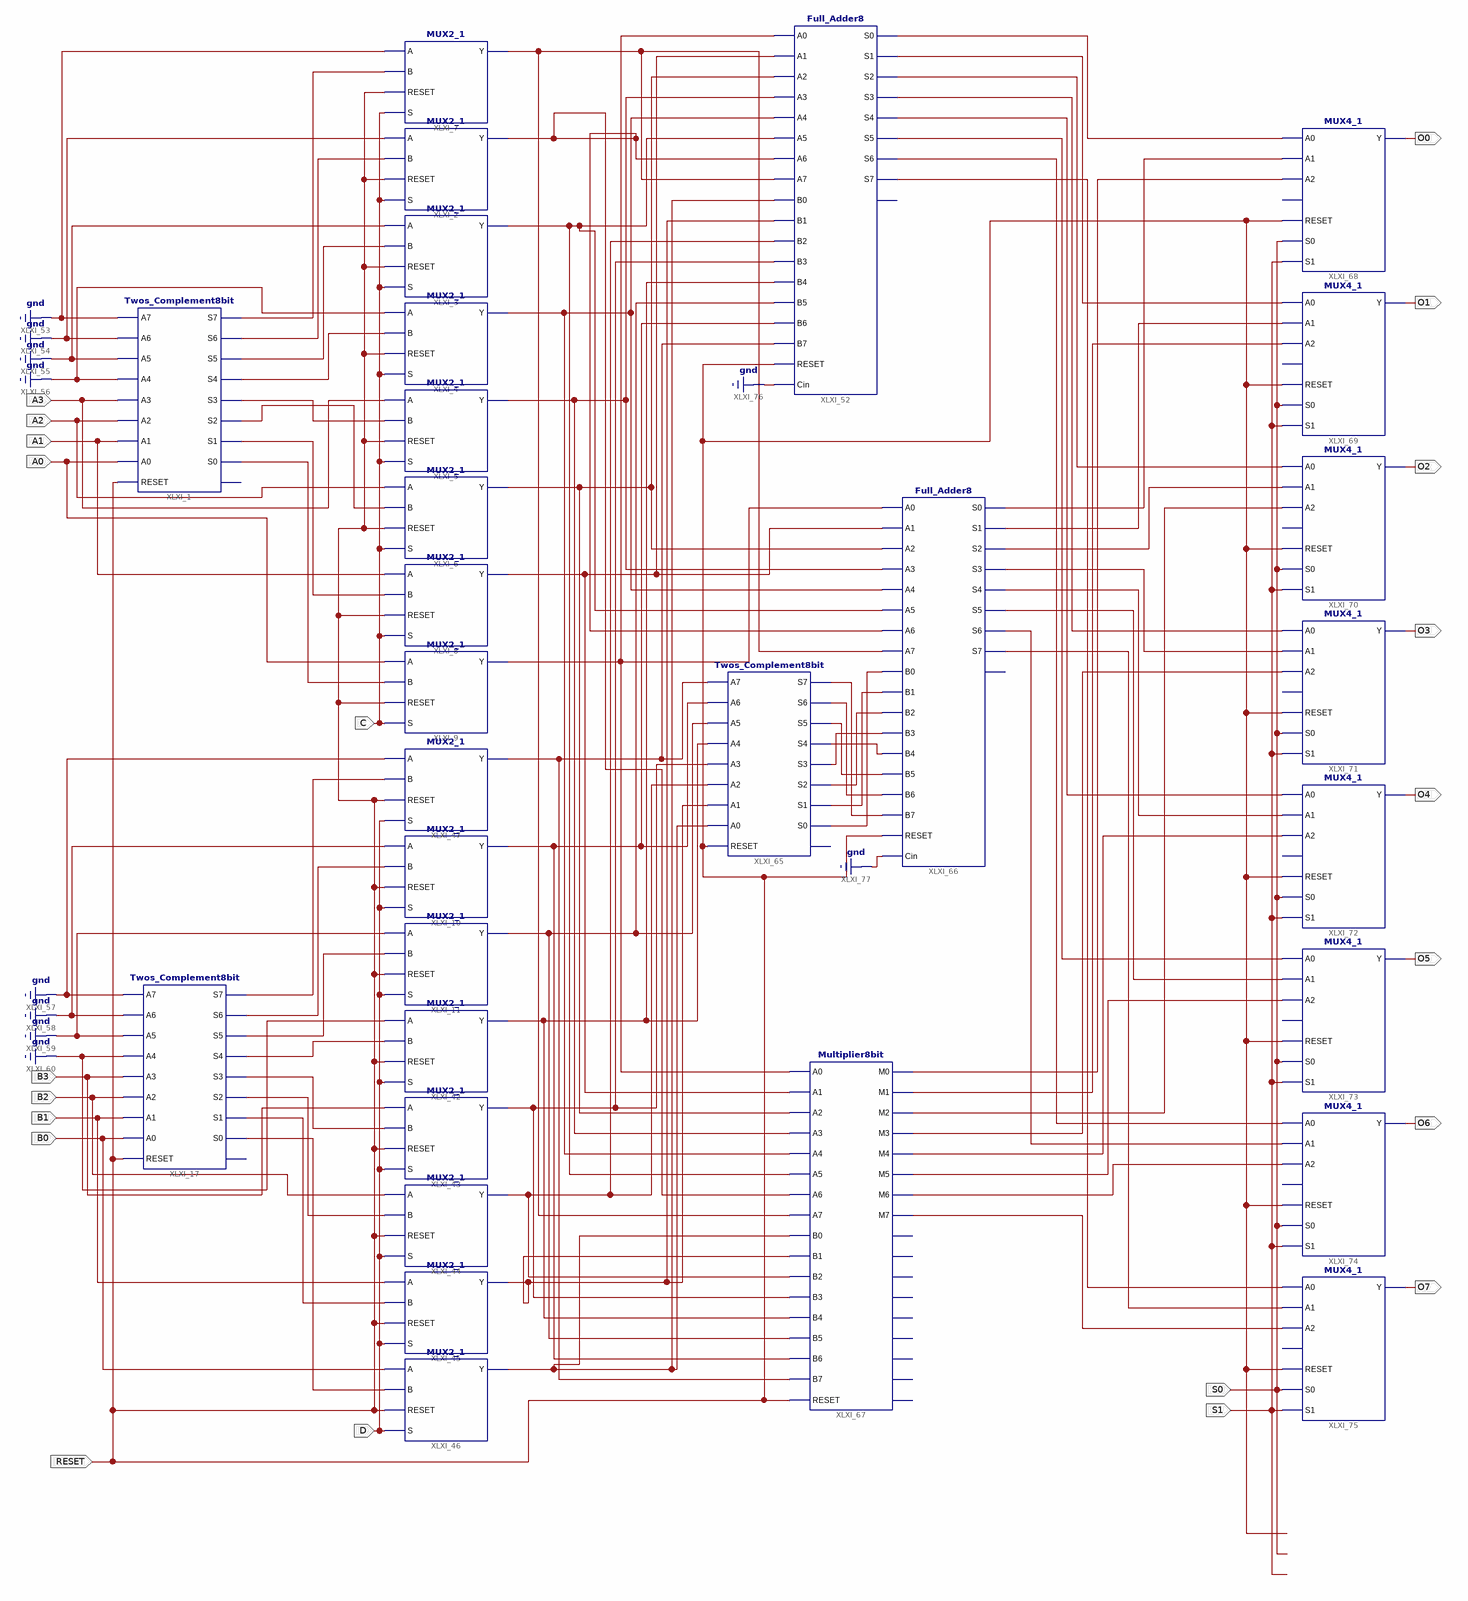
[diagram p0: schematic sheet 1]
// Xilinx ISE schematic Sign_Calculator_Led.sch (artix7) as structural Verilog: 30 symbols, 21 ports
module Sign_Calculator_Led (
  input  A3,
  input  A2,
  input  A0,
  input  B3,
  input  B2,
  input  B1,
  input  B0,
  input  C,
  input  D,
  input  S0,
  input  S1,
  input  RESET,
  input  A1,
  output O7,
  output O6,
  output O5,
  output O4,
  output O3,
  output O0,
  output O1,
  output O2
);

  wire XLXN_9, XLXN_12, XLXN_13, XLXN_14, XLXN_15, XLXN_16, XLXN_17, XLXN_18, XLXN_28, XLXN_29, XLXN_30,
       XLXN_31, XLXN_32, XLXN_33, XLXN_34, XLXN_40, XLXN_118, XLXN_125, XLXN_126, XLXN_130, XLXN_131,
       XLXN_132, XLXN_133, XLXN_134, XLXN_135, XLXN_136, XLXN_137, XLXN_139, XLXN_140, XLXN_141, XLXN_142,
       XLXN_144, XLXN_146, XLXN_147, XLXN_148, XLXN_150, XLXN_151, XLXN_152, XLXN_153, XLXN_154, XLXN_155,
       XLXN_157, XLXN_158, XLXN_159, XLXN_160, XLXN_161, XLXN_163, XLXN_165, XLXN_166, XLXN_167, XLXN_168,
       XLXN_170, XLXN_171, XLXN_172, XLXN_173, XLXN_174, XLXN_175, XLXN_176, XLXN_177, XLXN_179, XLXN_180,
       XLXN_181, XLXN_218, XLXN_247;

  Twos_Complement8bit XLXI_1 (
    .A0(A0), .A1(A1), .A2(A2), .A3(A3), .A4(1'b0), .A5(1'b0), .A6(1'b0), .A7(1'b0), .RESET(RESET),
    .S0(XLXN_18), .S1(XLXN_17), .S2(XLXN_16), .S3(XLXN_15), .S4(XLXN_14), .S5(XLXN_13), .S6(XLXN_12),
    .S7(XLXN_9));  // open: Cout
  MUX2_1 XLXI_2 (.A(1'b0), .B(XLXN_12), .RESET(RESET), .S(C), .Y(XLXN_40));
  MUX2_1 XLXI_3 (.A(1'b0), .B(XLXN_13), .RESET(RESET), .S(C), .Y(XLXN_247));
  MUX2_1 XLXI_4 (.A(1'b0), .B(XLXN_14), .RESET(RESET), .S(C), .Y(XLXN_142));
  MUX2_1 XLXI_5 (.A(A3), .B(XLXN_15), .RESET(RESET), .S(C), .Y(XLXN_141));
  MUX2_1 XLXI_6 (.A(A2), .B(XLXN_16), .RESET(RESET), .S(C), .Y(XLXN_140));
  MUX2_1 XLXI_7 (.A(1'b0), .B(XLXN_9), .RESET(RESET), .S(C), .Y(XLXN_144));
  MUX2_1 XLXI_8 (.A(A1), .B(XLXN_17), .RESET(RESET), .S(C), .Y(XLXN_139));
  MUX2_1 XLXI_9 (.A(A0), .B(XLXN_18), .RESET(RESET), .S(C), .Y(XLXN_118));
  MUX2_1 XLXI_10 (.A(1'b0), .B(XLXN_28), .RESET(RESET), .S(D), .Y(XLXN_147));
  MUX2_1 XLXI_11 (.A(1'b0), .B(XLXN_29), .RESET(RESET), .S(D), .Y(XLXN_148));
  MUX2_1 XLXI_42 (.A(1'b0), .B(XLXN_30), .RESET(RESET), .S(D), .Y(XLXN_150));
  MUX2_1 XLXI_43 (.A(B3), .B(XLXN_31), .RESET(RESET), .S(D), .Y(XLXN_151));
  MUX2_1 XLXI_45 (.A(B1), .B(XLXN_33), .RESET(RESET), .S(D), .Y(XLXN_125));
  MUX2_1 XLXI_46 (.A(B0), .B(XLXN_34), .RESET(RESET), .S(D), .Y(XLXN_126));
  MUX2_1 XLXI_44 (.A(B2), .B(XLXN_32), .RESET(RESET), .S(D), .Y(XLXN_152));
  Twos_Complement8bit XLXI_17 (
    .A0(B0), .A1(B1), .A2(B2), .A3(B3), .A4(1'b0), .A5(1'b0), .A6(1'b0), .A7(1'b0), .RESET(RESET),
    .S0(XLXN_34), .S1(XLXN_33), .S2(XLXN_32), .S3(XLXN_31), .S4(XLXN_30), .S5(XLXN_29), .S6(XLXN_28),
    .S7(XLXN_218));  // open: Cout
  Full_Adder8 XLXI_66 (
    .A0(XLXN_118), .A1(XLXN_139), .A2(XLXN_140), .A3(XLXN_141), .A4(XLXN_142), .A5(XLXN_247), .A6(XLXN_40),
    .A7(XLXN_144), .B0(XLXN_137), .B1(XLXN_136), .B2(XLXN_135), .B3(XLXN_134), .B4(XLXN_133), .B5(XLXN_132),
    .B6(XLXN_131), .B7(XLXN_130), .Cin(1'b0), .RESET(RESET), .S0(XLXN_163), .S1(XLXN_165), .S2(XLXN_166),
    .S3(XLXN_167), .S4(XLXN_168), .S5(XLXN_170), .S6(XLXN_171), .S7(XLXN_172));  // open: Cout
  Full_Adder8 XLXI_52 (
    .A0(XLXN_118), .A1(XLXN_139), .A2(XLXN_140), .A3(XLXN_141), .A4(XLXN_142), .A5(XLXN_247), .A6(XLXN_40),
    .A7(XLXN_144), .B0(XLXN_126), .B1(XLXN_125), .B2(XLXN_152), .B3(XLXN_151), .B4(XLXN_150), .B5(XLXN_148),
    .B6(XLXN_147), .B7(XLXN_146), .Cin(1'b0), .RESET(RESET), .S0(XLXN_153), .S1(XLXN_154), .S2(XLXN_155),
    .S3(XLXN_157), .S4(XLXN_158), .S5(XLXN_159), .S6(XLXN_160), .S7(XLXN_161));  // open: Cout
  Multiplier8bit XLXI_67 (
    .A0(XLXN_118), .A1(XLXN_139), .A2(XLXN_140), .A3(XLXN_141), .A4(XLXN_142), .A5(XLXN_247), .A6(XLXN_40),
    .A7(XLXN_144), .B0(XLXN_126), .B1(XLXN_125), .B2(XLXN_152), .B3(XLXN_151), .B4(XLXN_150), .B5(XLXN_148),
    .B6(XLXN_147), .B7(XLXN_146), .M0(XLXN_173), .M1(XLXN_174), .M2(XLXN_175), .M3(XLXN_176), .M4(XLXN_177),
    .M5(XLXN_179), .M6(XLXN_180), .M7(XLXN_181), .RESET(RESET));  // open: Cout, M10, M11, M12, M13, M14, M15, M8, M9
  MUX4_1 XLXI_68 (.A0(XLXN_153), .A1(XLXN_163), .A2(XLXN_173), .RESET(RESET), .S0(S0), .S1(S1), .Y(O0));  // open: A3
  MUX4_1 XLXI_69 (.A0(XLXN_154), .A1(XLXN_165), .A2(XLXN_174), .RESET(RESET), .S0(S0), .S1(S1), .Y(O1));  // open: A3
  MUX4_1 XLXI_70 (.A0(XLXN_155), .A1(XLXN_166), .A2(XLXN_175), .RESET(RESET), .S0(S0), .S1(S1), .Y(O2));  // open: A3
  MUX4_1 XLXI_71 (.A0(XLXN_157), .A1(XLXN_167), .A2(XLXN_176), .RESET(RESET), .S0(S0), .S1(S1), .Y(O3));  // open: A3
  MUX4_1 XLXI_72 (.A0(XLXN_158), .A1(XLXN_168), .A2(XLXN_177), .RESET(RESET), .S0(S0), .S1(S1), .Y(O4));  // open: A3
  MUX4_1 XLXI_73 (.A0(XLXN_159), .A1(XLXN_170), .A2(XLXN_179), .RESET(RESET), .S0(S0), .S1(S1), .Y(O5));  // open: A3
  MUX4_1 XLXI_74 (.A0(XLXN_160), .A1(XLXN_171), .A2(XLXN_180), .RESET(RESET), .S0(S0), .S1(S1), .Y(O6));  // open: A3
  MUX4_1 XLXI_75 (.A0(XLXN_161), .A1(XLXN_172), .A2(XLXN_181), .RESET(RESET), .S0(S0), .S1(S1), .Y(O7));  // open: A3
  MUX2_1 XLXI_47 (.A(1'b0), .B(XLXN_218), .RESET(RESET), .S(D), .Y(XLXN_146));
  Twos_Complement8bit XLXI_65 (
    .A0(XLXN_126), .A1(XLXN_125), .A2(XLXN_152), .A3(XLXN_151), .A4(XLXN_150), .A5(XLXN_148), .A6(XLXN_147),
    .A7(XLXN_146), .RESET(RESET), .S0(XLXN_137), .S1(XLXN_136), .S2(XLXN_135), .S3(XLXN_134), .S4(XLXN_133),
    .S5(XLXN_132), .S6(XLXN_131), .S7(XLXN_130));  // open: Cout
endmodule
